# EAGLE schematic LEDFB (EAGLE 7.5.0)
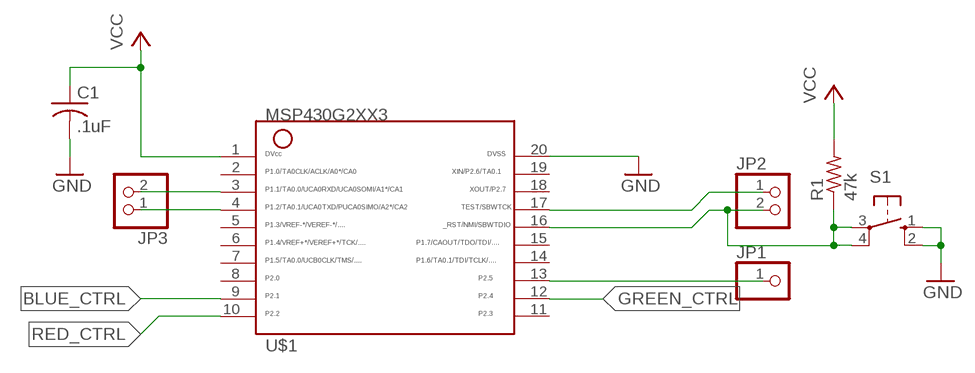
[diagram p0: schematic, sheet 1]

## Parts
C1  .1uF  C-USC0805  [C0805]
JP1  PINHD-1X1  [1X01]
JP2  PINHD-1X2  [1X02]
JP3  PINHD-1X2  [1X02]
R1  47k  R-US_R0805  [R0805]
S1  10-XX  [B3F-10XX]
U$1  G2XX3---PW20  [PW20]

## Nets
BLUE_CTRL: U$1.9
GND: C1.2 S1.1(S) S1.2(S1) U$1.20
N$1: JP3.2 U$1.3
N$2: JP3.1 U$1.4
N$3: JP1.1 U$1.13
N$6: JP2.1 U$1.17
N$7: JP2.2 R1.1 S1.3(P) S1.4(P1) U$1.16
RED_CTRL: U$1.10
VCC: C1.1 R1.2 U$1.1
Unconnected: U$1.2 U$1.5 U$1.6 U$1.7 U$1.8 U$1.11 U$1.12 U$1.14 U$1.15 U$1.18 U$1.19

## Library data of the parts
C1 = adafruit:C-US: CAPACITOR, American symbol
JP1 = pinhead:PINHD-1X1: PIN HEADER
JP2 JP3 = pinhead:PINHD-1X2: PIN HEADER
R1 = adafruit:R-US_: RESISTOR, American symbol
S1 = switch-omron:10-XX: OMRON SWITCH; MPN: B3F-1000; OC_FARNELL: 176432; OC_NEWARK: 36M3542
U$1 = TI_MSP430_v16:G2XX3---PW20: MSP430G2XX1 TSSOP (PW) 20 Pin Package